# Altium schematic sheet Индикатор с драйвером.SchDoc
size A4
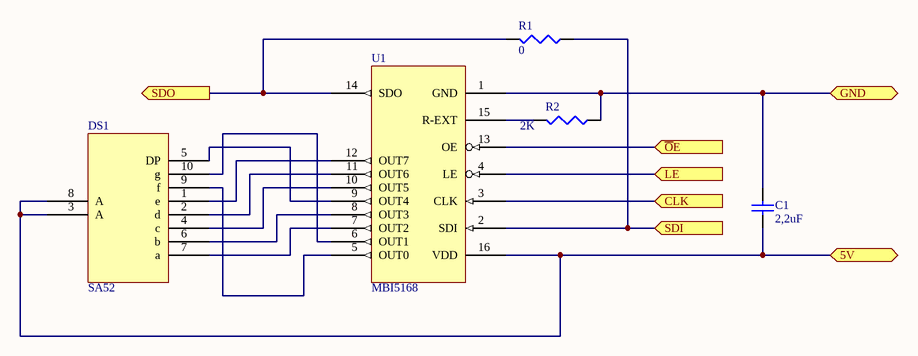
[diagram p0: Индикатор с драйвером.SchDoc]

## Parts
C1  value 2,2uF  [CAPC1608L]  (hidden comment: Cap Semi)
DS1  SA52  [LED52]
R1  0  [RESC1608L]
R2  value 2K  [RESC1608L]  (hidden comment: Res3)
U1  MBI5168  [SO-16_M]

## Ports
5V, CLK (in), GND, LE (in), SDI (in), SDO (out), ~{O}E (in)

## Nets
5V: C1.2 DS1.3(A) DS1.8(A) U1.16(VDD) ; port 5V
~{O}E: U1.13(OE) ; port ~{O}E
CLK: U1.3(CLK) ; port CLK
GND: C1.1 R2.1 U1.1(GND) ; port GND
LE: U1.4(LE) ; port LE
SDI: R1.1 U1.2(SDI) ; port SDI
SDO: R1.2 U1.14(SDO) ; port SDO
NetDS1_1: DS1.1(e) U1.12(OUT7)
NetDS1_2: DS1.2(d) U1.11(OUT6)
NetDS1_4: DS1.4(c) U1.10(OUT5)
NetDS1_5: DS1.5(DP) U1.9(OUT4)
NetDS1_6: DS1.6(b) U1.8(OUT3)
NetDS1_7: DS1.7(a) U1.7(OUT2)
NetDS1_9: DS1.9(f) U1.5(OUT0)
NetDS1_10: DS1.10(g) U1.6(OUT1)
NetR2_2: R2.2 U1.15(R-EXT)

## Library data of the parts
C1 = Cap Semi: Capacitor (Semiconductor SIM Model); Published: 8-Jun-2000; LatestRevisionDate: 29-May-2009; LatestRevisionNote: IPC-7351 Footprint Added.; PackageReference: C1206; Publisher: Altium Limited; PackageDescription: Chip Capacitor
DS1 = SA52-11: KingBright, SA23-11
R1 R2 = Res3: Resistor; Published: 8-Jun-2000; LatestRevisionDate: 29-May-2009; LatestRevisionNote: IPC-7351 Footprint Added.; PackageReference: J1-0603; Publisher: Altium Limited; PackageDescription: Chip Resistor
  R1: Value: 0
U1 = MBI5168: Macroblock, 8-bit Constant Current LED Sink Driver